# EAGLE design pi_hat (EAGLE 9.6.2)
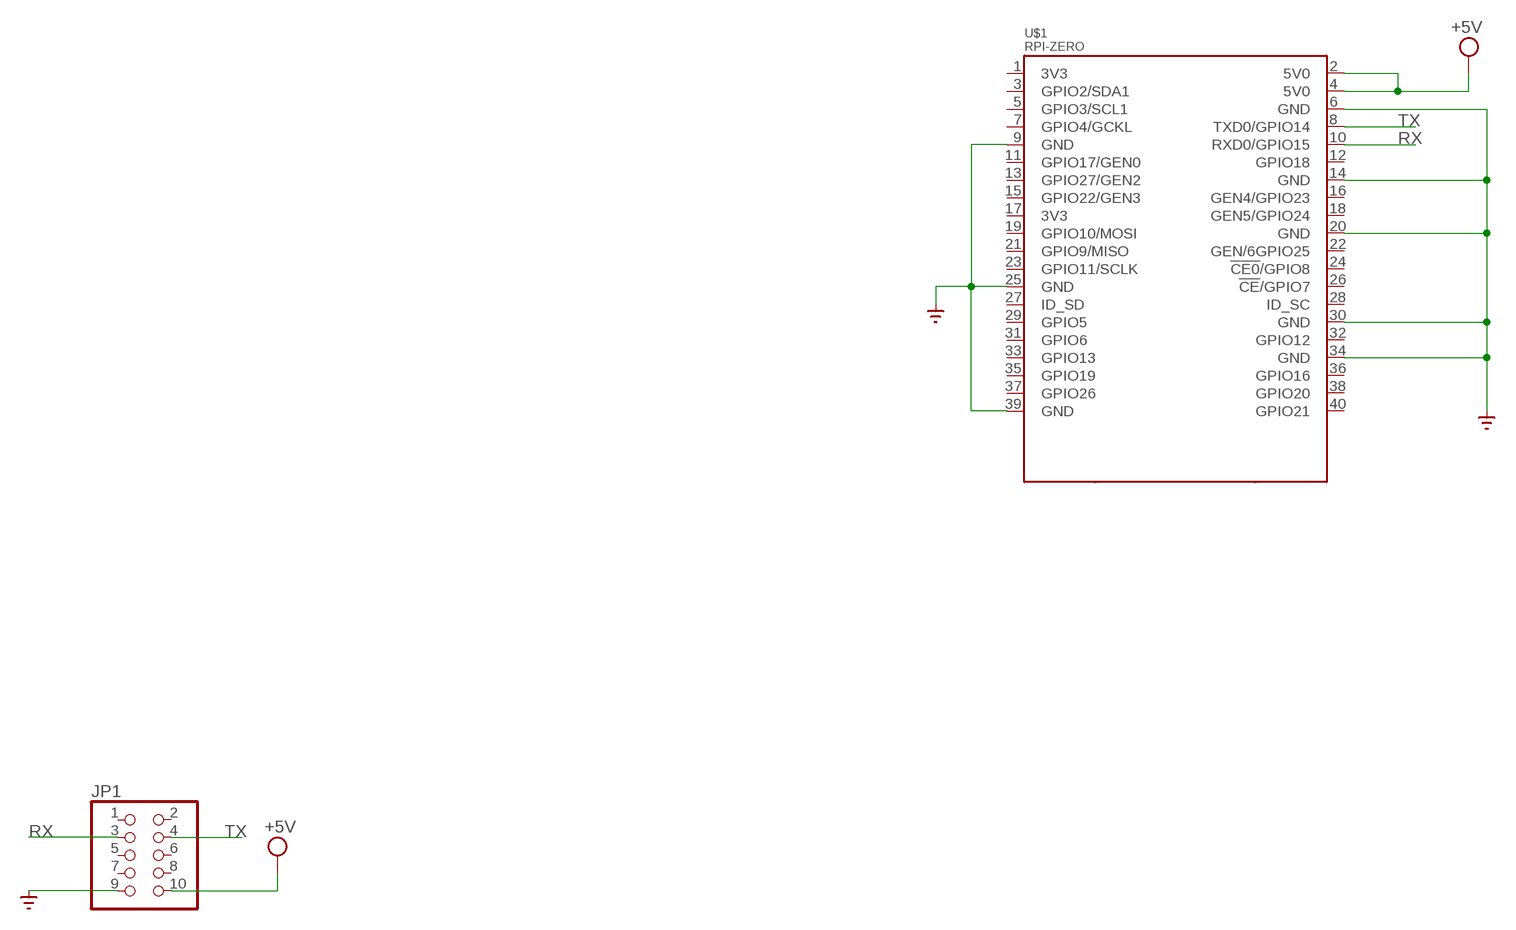
[diagram p0: schematic, sheet 1]

## Parts
JP1  PINHD-2X5/90  [2X05/90]
U$1  RPI-ZERO  [RASPBERRYPI_BASTELSTUBE_V13_RASPI_BOARD_B+_FULL]

## Nets
+5V: JP1.10 U$1.2(5V0) U$1.4(5V0)
GND: JP1.9 U$1.6(GND) U$1.9(GND) U$1.14(GND) U$1.20(GND) U$1.25(GND) U$1.30(GND) U$1.34(GND) U$1.39(GND) ; supply symbol labelled SUPPLY0_GND_
RX: JP1.3 U$1.10(RXD0/GPIO15)
TX: JP1.4 U$1.8(TXD0/GPIO14)
Unconnected: JP1.1 JP1.2 JP1.5 JP1.6 JP1.7 JP1.8 U$1.1(3V3) U$1.3(GPIO2/SDA1) U$1.5(GPIO3/SCL1) U$1.7(GPIO4/GCKL) U$1.11(GPIO17/GEN0) U$1.12(GPIO18) U$1.13(GPIO27/GEN2) U$1.15(GPIO22/GEN3) U$1.16(GEN4/GPIO23) U$1.17(3V3) U$1.18(GEN5/GPIO24) U$1.19(GPIO10/MOSI) U$1.21(GPIO9/MISO) U$1.22(GEN/6GPIO25) U$1.23(GPIO11/SCLK) U$1.24(!CE0!/GPIO8) U$1.26(!CE!/GPIO7) U$1.27(ID_SD) U$1.28(ID_SC) U$1.29(GPIO5) U$1.31(GPIO6) U$1.32(GPIO12) U$1.33(GPIO13) U$1.35(GPIO19) U$1.36(GPIO16) U$1.37(GPIO26) U$1.38(GPIO20) U$1.40(GPIO21)

## Library data of the parts
JP1 = pinhead:PINHD-2X5: PIN HEADER
U$1 = RPI-Zero:RPI-ZERO

## Board
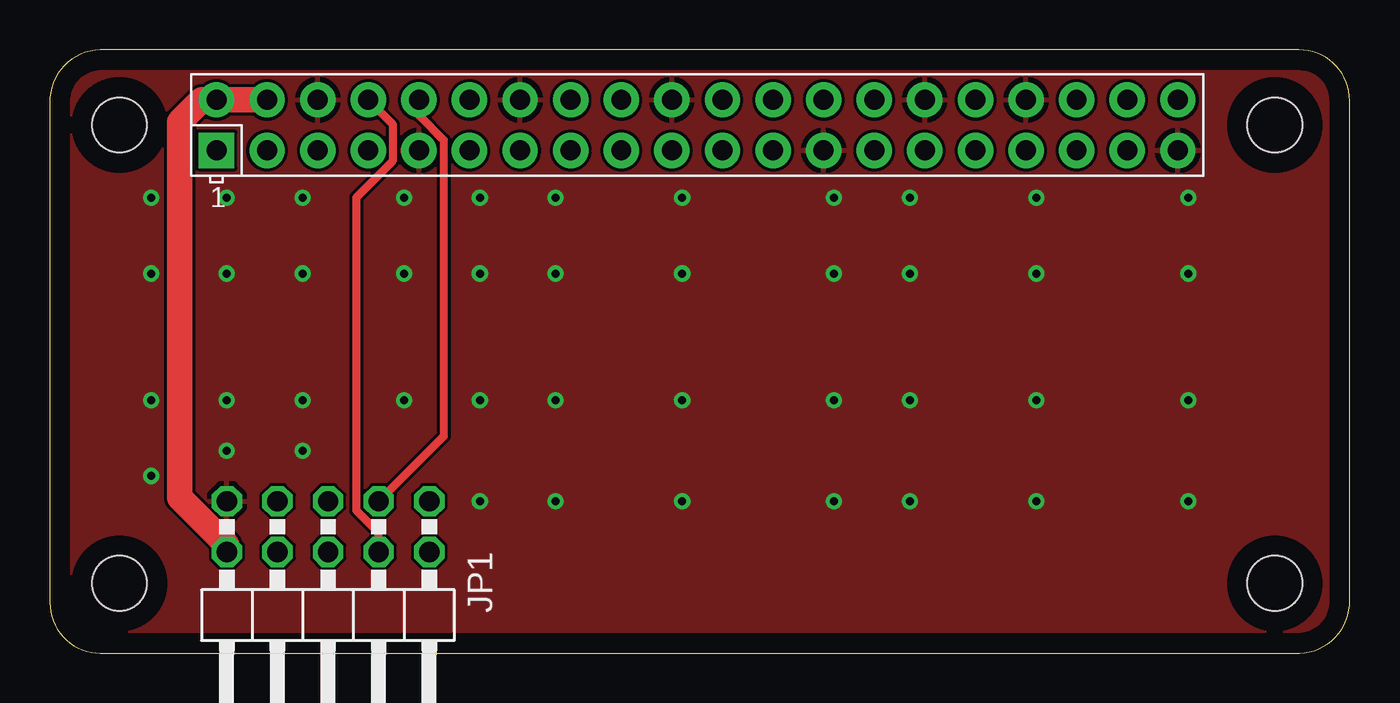
[diagram p1: board, top side]
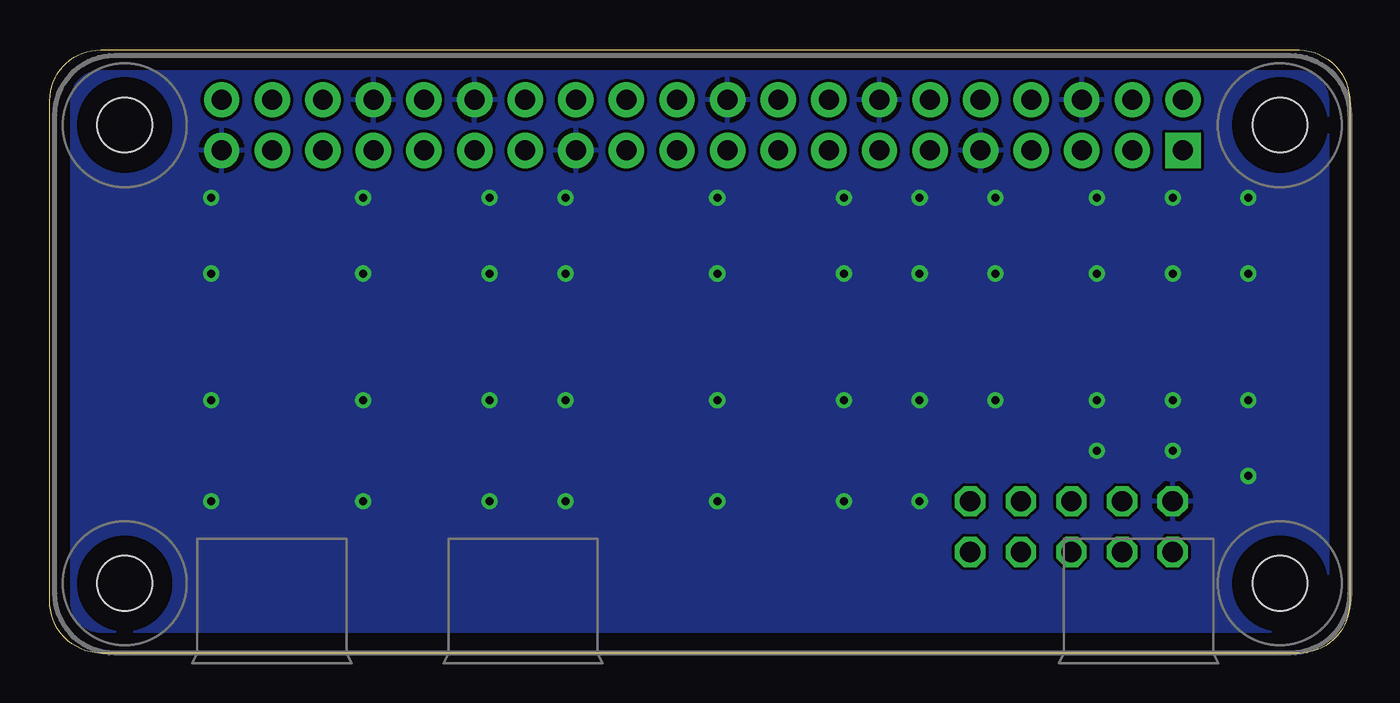
[diagram p2: board, bottom side, seen from below]

Size 65.26 x 30.28 mm. Coordinates in mm from the lower left corner, seen from the top.
Outline: 62.71,30.28 2.54,30.28 arc90 0,27.61 0,2.54 arc90 2.54,0 62.72,0 arc90 65.26,2.66 65.26,27.73 arc90 62.71,30.28
Copper layers (1*16): Top 0.035mm / dielectric 1.5mm / Bottom 0.035mm
Design rules "default *": minimum track width 6mil, minimum drill 0.35mm, track to track 6mil, track to pad 6mil, pad to pad 6mil, via to via 6mil, smd to smd 6mil, copper to edge 40mil, drill to drill 6mil, minimum pad ring 10mil, minimum via ring 8mil, stop-mask expansion 4mil, vias tented up to drill 40mil, thermal gap 10mil

### Footprints (pad centres in the part's own frame; a part is rotated, then mirrored left to right if it is on the bottom)
2X05/90 = drill 1.016 octagon: 1 -5.08,-6.35; 2 -5.08,-3.81; 3 -2.54,-6.35; 4 -2.54,-3.81; 5 0,-6.35; 6 0,-3.81; 7 2.54,-6.35; 8 2.54,-3.81; 9 5.08,-6.35; 10 5.08,-3.81
RASPBERRYPI_BASTELSTUBE_V13_RASPI_BOARD_B+_FULL = drill 1 pad 1.778 square: 1 8.37,25.23 | drill 1 pad 1.778: 2 8.37,27.77; 3 10.91,25.23; 4 10.91,27.77; 5 13.45,25.23; 6 13.45,27.77; 7 15.99,25.23; 8 15.99,27.77; 9 18.53,25.23; 10 18.53,27.77; 11 21.07,25.23; 12 21.07,27.77; 13 23.61,25.23; 14 23.61,27.77; 15 26.15,25.23; 16 26.15,27.77; 17 28.69,25.23; 18 28.69,27.77; 19 31.23,25.23; 20 31.23,27.77; 21 33.77,25.23; 22 33.77,27.77; 23 36.31,25.23; 24 36.31,27.77; 25 38.85,25.23; 26 38.85,27.77; 27 41.39,25.23; 28 41.39,27.77; 29 43.93,25.23; 30 43.93,27.77; 31 46.47,25.23; 32 46.47,27.77; 33 49.01,25.23; 34 49.01,27.77; 35 51.55,25.23; 36 51.55,27.77; 37 54.09,25.23; 38 54.09,27.77; 39 56.63,25.23; 40 56.63,27.77 | hole 2.75: 3.5,3.5; 3.5,26.5; 61.5,3.5; 61.5,26.5

### Placement (x,y rotation side)
JP1  13.97,1.27 180 top
U$1  0,0 0 top

### Tracks (layer width: path | path; a pad name or v marks a point on that pad's centre or on a via)
+5V
  Top 1.27: JP1.10 8.89,5.43 6.53,7.79 6.53,26.67 7.63,27.77 U$1.2 U$1.4
GND  (via drill 0.4)
  other vias: 5.08,19.05 8.89,19.05 17.78,19.05 21.59,19.05 31.75,19.05 39.37,19.05 49.53,19.05 57.15,19.05 57.15,12.7 49.53,12.7 39.37,12.7 31.75,12.7 21.59,12.7 17.78,12.7 8.89,12.7 5.08,12.7 12.7,19.05 12.7,12.7 25.4,19.05 25.4,12.7 43.18,19.05 43.18,12.7 5.08,8.89 8.89,10.16 12.7,10.16 21.59,7.62 25.4,7.62 31.75,7.62 39.37,7.62 43.18,7.62 49.53,7.62 57.15,7.62 5.08,22.86 8.89,22.86 12.7,22.86 17.78,22.86 21.59,22.86 25.4,22.86 31.75,22.86 39.37,22.86 43.18,22.86 49.53,22.86 57.15,22.86
  pour Top: 65.28,27.69 65.28,2.54 arc-90 62.74,0 2.54,0 arc-90 0,2.54 0,27.69 arc-90 2.54,30.23 62.74,30.23 arc-90
  pour Bottom: 2.54,0 62.74,0 arc90 65.28,2.54 65.28,27.56 arc90 62.74,30.1 2.54,30.1 arc90 0,27.56 0,2.54 arc90
RX
  Top 0.406: U$1.10 18.53,26.99 19.77,25.75 19.77,10.88 JP1.3
TX
  Top 0.406: JP1.4 16.51,6.04 15.39,7.16 15.39,22.87 17.23,24.71 17.23,26.52 U$1.8